# Altium schematic sheet EMGfrontend.SchDoc
size A; SheetNumber: 1; SheetTotal: 6
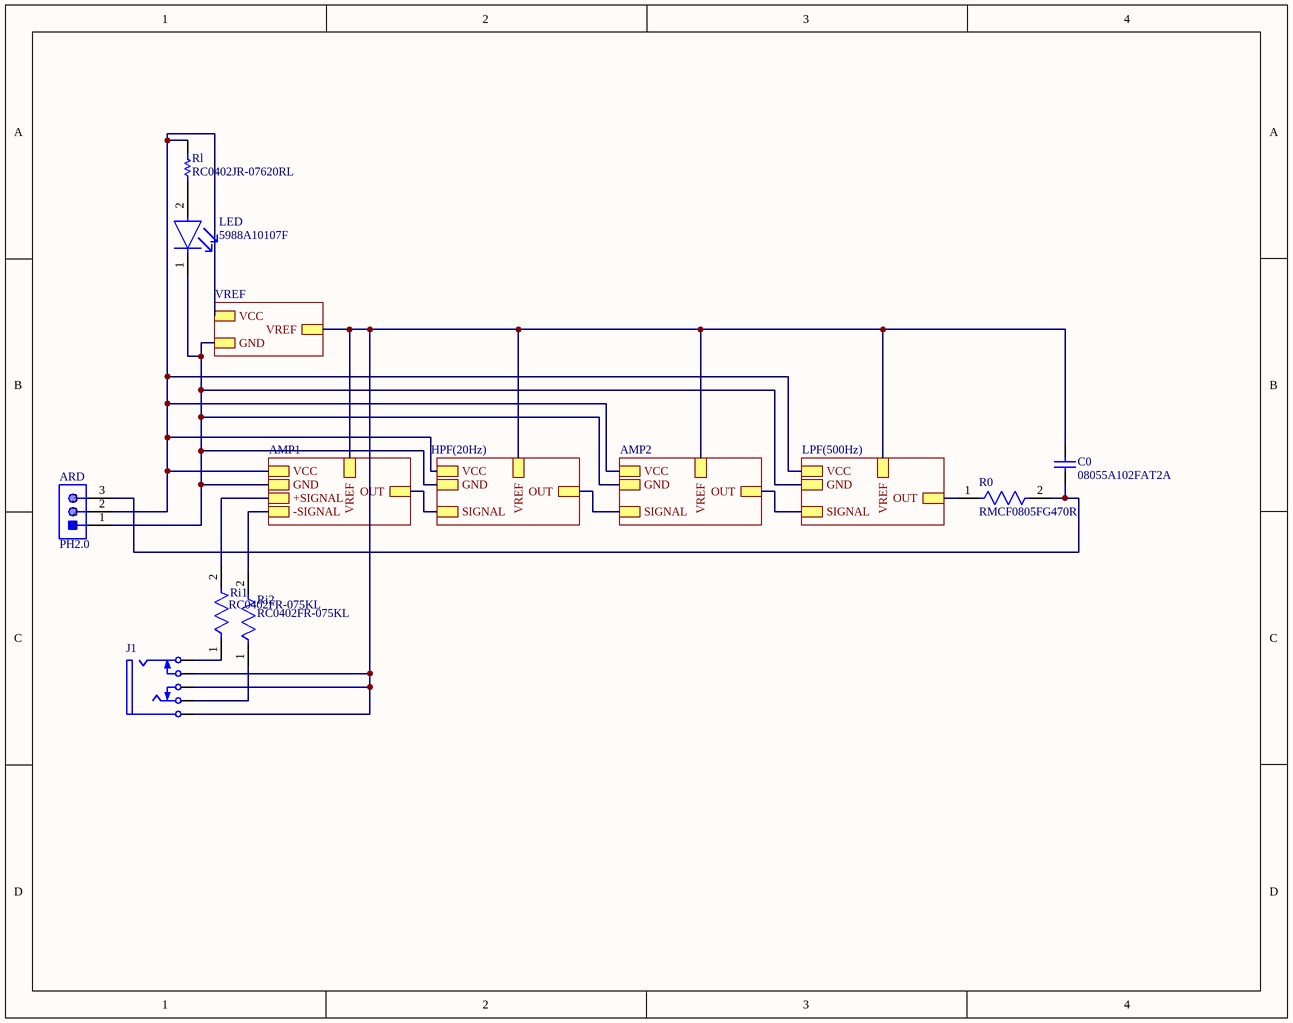
[diagram p0: EMGfrontend.SchDoc]

## Parts
ARD  PH2.0  [JST-B3B-PH-K-S-3_V]
C0  08055A102FAT2A  [CAPC2013X94X50NL20T25]
J1  (no value)  [SWIT-35RASMT4BHNTRX_V]
LED  5988A10107F  [FP-5988A10107F-MFG]
R0  RMCF0805FG470R  [FP-RMCF0805-IPC_C]
Ri1  RC0402FR-075KL  [FP-RC0402-MFG]
Ri2  RC0402FR-075KL  [FP-RC0402-MFG]
Rl  RC0402JR-07620RL  [RESC1005X40X25ML05T10]

## Sub-sheets
AMP1 = AMP1.SchDoc: VREF, +SIGNAL, OUT, GND, VCC, -SIGNAL
AMP2 = AMP2.SchDoc: VREF, SIGNAL, VCC, GND, OUT
HPF(20Hz) = HPF(20Hz).SchDoc: SIGNAL, VREF, OUT, VCC, GND
LPF(500Hz) = LPF(500Hz).SchDoc: SIGNAL, VCC, GND, VREF, OUT
VREF = VREF.SchDoc: VREF, VCC, GND

## Nets
NetARD_1: ARD.1 LED.1(C) ; sheet VREF/GND, sheet AMP2/GND, sheet LPF(500Hz)/GND, sheet AMP1/GND, sheet HPF(20Hz)/GND
NetARD_2: ARD.2 Rl.2 ; sheet VREF/VCC, sheet AMP2/VCC, sheet LPF(500Hz)/VCC, sheet AMP1/VCC, sheet HPF(20Hz)/VCC
NetARD_3: ARD.3 C0.1 R0.2
NetC0_2: C0.2 J1.1 J1.4 J1.5 ; sheet VREF/VREF, sheet AMP2/VREF, sheet LPF(500Hz)/VREF, sheet AMP1/VREF, sheet HPF(20Hz)/VREF
NetJ1_2: J1.2 Ri1.1
NetJ1_3: J1.3 Ri2.1
NetLED_2: LED.2(A) Rl.1
NetR0_1: R0.1 ; sheet LPF(500Hz)/OUT
NetRi1_2: Ri1.2 ; sheet AMP1/+SIGNAL
NetRi2_2: Ri2.2 ; sheet AMP1/-SIGNAL
(unnamed): sheet AMP2/SIGNAL, sheet HPF(20Hz)/OUT
(unnamed): sheet AMP2/OUT, sheet LPF(500Hz)/SIGNAL
(unnamed): sheet AMP1/OUT, sheet HPF(20Hz)/SIGNAL

## Library data of the parts
ARD = CMP-2000-05164-1: Male Header, Pitch 2 mm, 1 x 3 Position, Height 6 mm, Tail Length 3.4 mm, -25 to 85 degC, RoHS, Bulk; Manufacturer: JST; Style/Orientation: StraightHeader/Plug; Pitch: 2mm; No of Positions: 3; Termination: Crimp; Manufacturer URL: http://www.jst.com/home2.html; Datasheet Version: Oct-06; Type: ShroudedHeader; Datasheet URL: https://datasheet.ciiva.com/11746/0900766b80826550-11746939.pdf
C0 = CMP-2007-04267-1: Manufacturer: AVX Interconnect / Elco; Part Number: 08055A102FAT2A
J1 = CMP-1772-00001-1: Female 3.5 mm Phone Jack, 5 Position, Height 5 mm, RoHS, Tape and Reel; Current Rating: 50 mA; Voltage Rating (DC): 12 V; ComponentLink1URL: http://www.switchcraft.com/; ComponentLink2Description: Datasheet; ComponentLink2URL: http://www.switchcraft.com/Drawings/35rasmt4bhntrx_cd.pdf; PackageDescription: Female 3.5 mm Phone Jack, 5 Position, Height 5 mm; PackageReference: 35RASMT4BHNTRX; Mount: Through Hole; DatasheetVersion: Rev. C, 07/2014; Contact Material: Silver; ComponentLink1Description: Manufacturer URL; Packaging: Tape and Reel; RoHSCompliant: true; Contact Plating: Silver; Package Quantity: 3000
LED = CMP-00106-100993512-1: 5988A10107F LED Uni-Color Red 2-Pin Chip 0402(1006Metric) T/R; Forward Voltage: 1.6V; Forward Current: 5mA; Power Dissipation: 46mW; Reverse Voltage: 5V; Luminous Intensity: 65mcd; Viewing Angle: 140°; Wavelength: 635nm; Max Operating Temperature: 85°C; Case/Package: 0402; Color: Red; Height: 533.4µm; NexarPartId: 100993512; RoHS: Compliant; Schedule B: 8541402000, 8541402000; Min Operating Temperature: -40°C
R0 = CMP-26527-003746-1: 470Ω ±1% 0.125W 0805 Thick Film Chip Resistor AEC-Q200 compliant; Resistance: 470R; Temperature Coefficient: 100ppm/°C; Max Power Dissipation: 125mW; Resistor Type: Thick Film; Number of Terminations: 2; Packaging: Tape and Reel; RoHS Compliant: Yes; Case/Package: 0805; Mount: Surface Mount; Contact Plating: Tin; Series: RMCF; Min Operating Temperature: -55°C; Radiation Hardening: No; Features: Automotive AEC-Q200; Tolerance: 1%; Max Operating Temperature: 155°C
Ri1 Ri2 = CMP-03412-013078-1: RES SMD 5K OHM 1% 1/16W 0402; Manufacturer: Yageo; Resistance: 5kΩ; Temperature Coefficient: 100ppm/°C; Power Rating: 0.0625W; Voltage Rating: 50V; Value: 5kΩ; Temperature Range Low: -55°C; Lead Free: Yes; RoHS: TRUE; Device Class L2: Resistors; Package: RC0402; Footprint Url: https://pccomponents.com/datasheets/YAGEO-20RESISTORS.PDF; Height: 0.4mm; ComponentLink2URL: http://www.yageo.com/documents/recent/PYu-RC_Group_51_RoHS_L_10.pdf; Temperature: -55°C to +155°C; Composition: Thick Film; Device Class L1: Passive Components; Series: RC_L; Ipc Land Pattern Name: RESC10050X35; Tolerance: 1%; Device Class L3: Chip SMD Resistors; Temperature Range High: +155°C; Category: Res; Automotive: No; Octopart: https://octopart.com/rc0402fr-075kl-yageo-25450038; Digikey Description: RES SMD 5K OHM 1% 1/16W 0402; ComponentLink2Description: Datasheet; Manufacturer Part Number: RC0402FR-075KL
Rl = CMP-2002-07079-1: Manufacturer: Yageo / Phycomp; Part Number: RC0402JR-07620RL